# Altium schematic sheet FIT_HDMI_X31-7.SchDoc: FIT_PM12 board
size 420 x 297 mm; CheckedBy: G.Kasprowicz; Author: INR Moscow; CompanyName: WUT ISE; DrawnBy: M.Podgórski; Organization: WUT ISE; Address1: PW ISE; Address2: Nowowiejska 15/19 00-665 Warsaw; Address3: gkasprow@gmail.com; Revision: 2; SheetNumber: -; SheetTotal: -; ModifiedBy: -; CheckedDate: -; Title2: Title 2; DivGrp: WUT ISE; Designer: INR RAS; ModifiedDate: -; ProjectName: Sensor Box
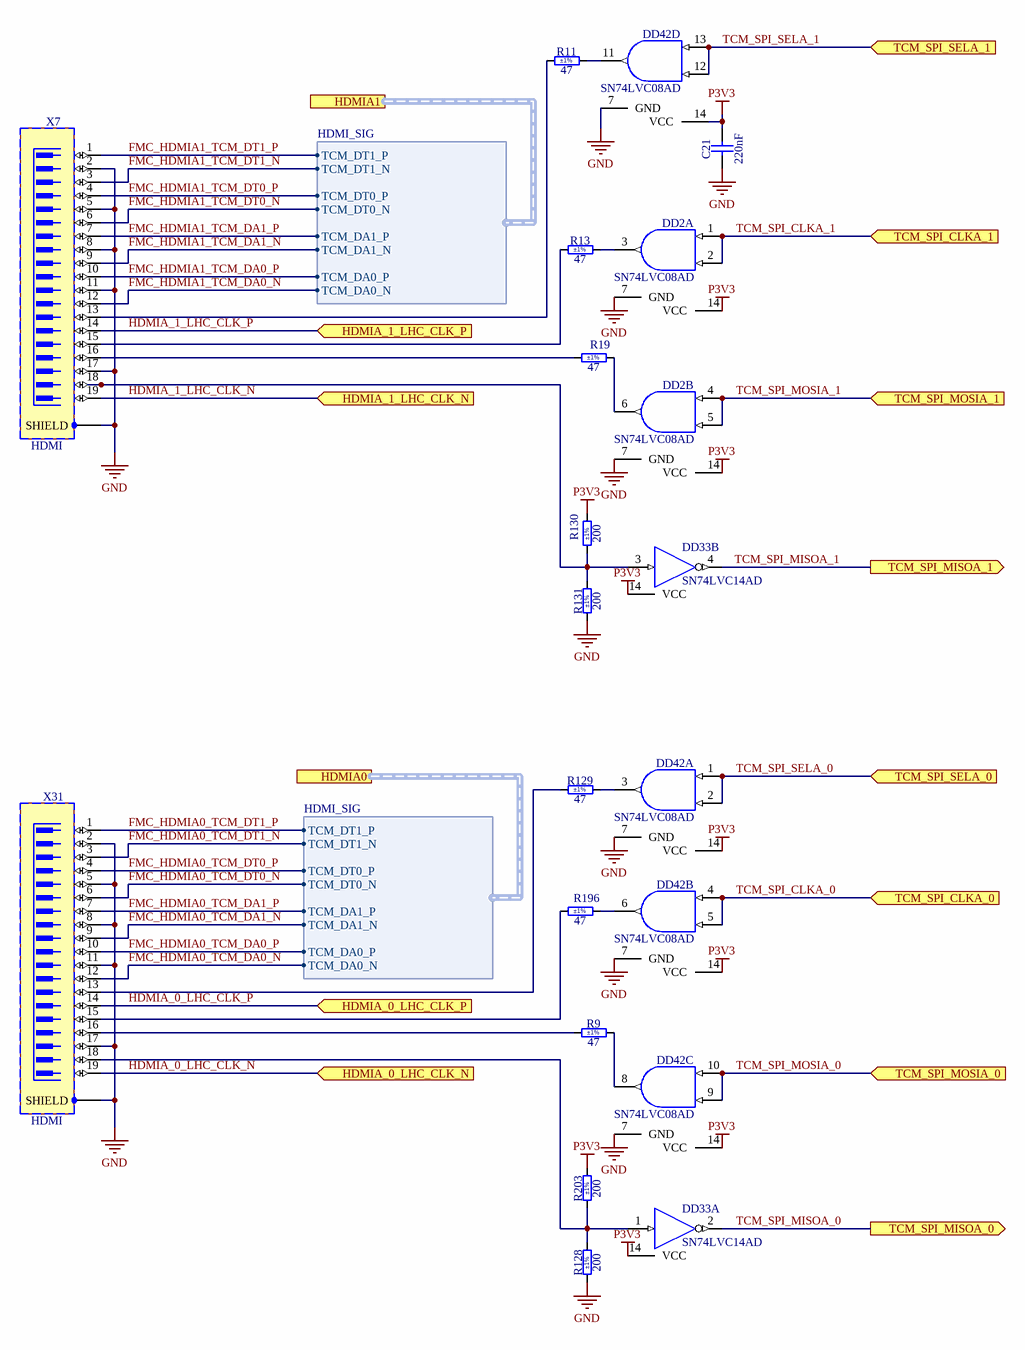
[diagram p0: FIT_HDMI_X31-7.SchDoc]

## Parts
C21  220nF  [CAPC2012X135N]
DD2  SN74LVC08AD  [SOIC127P600X175-14N]  (parts A,B of 4)
DD33  SN74LVC14AD  [SOIC127P600X175-14N]  (parts A,B of 6)
DD42  SN74LVC08AD  [SOIC127P600X175-14N]  (parts A,B,C,D of 4)
R9  47  Tolerance: ±1%  [RESC2012X60N]
R11  47  Tolerance: ±1%  [RESC2012X60N]
R13  47  Tolerance: ±1%  [RESC2012X60N]
R19  47  Tolerance: ±1%  [RESC2012X60N]
R128  200  Tolerance: ±1%  [RESC2012X60N]
R129  47  Tolerance: ±1%  [RESC2012X60N]
R130  200  Tolerance: ±1%  [RESC2012X60N]
R131  200  Tolerance: ±1%  [RESC2012X60N]
R196  47  Tolerance: ±1%  [RESC2012X60N]
R203  200  Tolerance: ±1%  [RESC2012X60N]
X7  HDMI  [TYCO_2007435-1]
X31  HDMI  [TYCO_2007435-1]

## Ports
HDMIA0 (harness HDMI_SIG), HDMIA1 (harness HDMI_SIG), HDMIA_0_LHC_CLK_N (in), HDMIA_0_LHC_CLK_P (in), HDMIA_1_LHC_CLK_N (in), HDMIA_1_LHC_CLK_P (in), TCM_SPI_CLKA_0 (in), TCM_SPI_CLKA_1 (in), TCM_SPI_MISOA_0 (out), TCM_SPI_MISOA_1 (out), TCM_SPI_MOSIA_0 (in), TCM_SPI_MOSIA_1 (in), TCM_SPI_SELA_0 (in), TCM_SPI_SELA_1 (in)

## Harnesses
HDMI_SIG: TCM_DT1_P, TCM_DT1_N, TCM_DT0_P, TCM_DT0_N, TCM_DA1_P, TCM_DA1_N, TCM_DA0_P, TCM_DA0_N

## Nets
GND: C21.1 DD2.7(GND) DD33.7(GND) DD42.7(GND) R128.1 R131.1 X7.2 X7.5 X7.8 X7.11 X7.17 X7.SHIELD X31.2 X31.5 X31.8 X31.11 X31.17 X31.SHIELD
P3V3: C21.2 DD2.14(VCC) DD33.14(VCC) DD42.14(VCC) R130.2 R203.2  [also labelled VCC]
FMC_HDMIA0_TCM_DA0_N: X31.12 ; port HDMIA0.TCM_DA0_N
FMC_HDMIA0_TCM_DA0_P: X31.10 ; port HDMIA0.TCM_DA0_P
FMC_HDMIA0_TCM_DA1_N: X31.9 ; port HDMIA0.TCM_DA1_N
FMC_HDMIA0_TCM_DA1_P: X31.7 ; port HDMIA0.TCM_DA1_P
FMC_HDMIA0_TCM_DT0_N: X31.6 ; port HDMIA0.TCM_DT0_N
FMC_HDMIA0_TCM_DT0_P: X31.4 ; port HDMIA0.TCM_DT0_P
FMC_HDMIA0_TCM_DT1_N: X31.3 ; port HDMIA0.TCM_DT1_N
FMC_HDMIA0_TCM_DT1_P: X31.1 ; port HDMIA0.TCM_DT1_P
FMC_HDMIA1_TCM_DA0_N: X7.12 ; port HDMIA1.TCM_DA0_N
FMC_HDMIA1_TCM_DA0_P: X7.10 ; port HDMIA1.TCM_DA0_P
FMC_HDMIA1_TCM_DA1_N: X7.9 ; port HDMIA1.TCM_DA1_N
FMC_HDMIA1_TCM_DA1_P: X7.7 ; port HDMIA1.TCM_DA1_P
FMC_HDMIA1_TCM_DT0_N: X7.6 ; port HDMIA1.TCM_DT0_N
FMC_HDMIA1_TCM_DT0_P: X7.4 ; port HDMIA1.TCM_DT0_P
FMC_HDMIA1_TCM_DT1_N: X7.3 ; port HDMIA1.TCM_DT1_N
FMC_HDMIA1_TCM_DT1_P: X7.1 ; port HDMIA1.TCM_DT1_P
HDMIA_0_LHC_CLK_N: X31.19 ; port HDMIA_0_LHC_CLK_N
HDMIA_0_LHC_CLK_P: X31.14 ; port HDMIA_0_LHC_CLK_P
HDMIA_1_LHC_CLK_N: X7.19 ; port HDMIA_1_LHC_CLK_N
HDMIA_1_LHC_CLK_P: X7.14 ; port HDMIA_1_LHC_CLK_P
TCM_SPI_CLKA_0: DD42.4(A) DD42.5(B) ; port TCM_SPI_CLKA_0
TCM_SPI_CLKA_1: DD2.1(A) DD2.2(B) ; port TCM_SPI_CLKA_1
TCM_SPI_MISOA_0: DD33.2(OUT) ; port TCM_SPI_MISOA_0
TCM_SPI_MISOA_1: DD33.4(OUT) ; port TCM_SPI_MISOA_1
TCM_SPI_MOSIA_0: DD42.9(B) DD42.10(A) ; port TCM_SPI_MOSIA_0
TCM_SPI_MOSIA_1: DD2.4(A) DD2.5(B) ; port TCM_SPI_MOSIA_1
TCM_SPI_SELA_0: DD42.1(A) DD42.2(B) ; port TCM_SPI_SELA_0
TCM_SPI_SELA_1: DD42.12(B) DD42.13(A) ; port TCM_SPI_SELA_1
NetDD2_3: DD2.3(Y) R13.2
NetDD2_6: DD2.6(Y) R19.2
NetDD33_1: DD33.1(IN) R128.2 R203.1 X31.18
NetDD33_3: DD33.3(IN) R130.1 R131.2 X7.18
NetDD42_3: DD42.3(Y) R129.2
NetDD42_6: DD42.6(Y) R196.2
NetDD42_8: DD42.8(Y) R9.2
NetDD42_11: DD42.11(Y) R11.2
NetR9_1: R9.1 X31.16
NetR11_1: R11.1 X7.13
NetR13_1: R13.1 X7.15
NetR19_1: R19.1 X7.16
NetR129_1: R129.1 X31.13
NetR196_1: R196.1 X31.15

## Notes on the sheet
- Project/Equipment
- Document
- Designer
- Drawn by
- Check.by
- Copyright WUT ISE 2024.
  This documentation describes Open Hardware and is licensed under the CERN OHL v.2. You may redistribute and modify this documentation under the terms of the CERN OHL v.2. (http://ohwr.org/CERNOHL). This documentation is distributed WITHOUT ANY EXPRESS OR IMPLIED WARRANTY, INCLUDING OF MERCHANTABILITY, SATISFACTORY QUALITY AND FITNESS FOR A PARTICULAR PURPOSE. Please see the CERN OHL v.2 for applicable conditions.
- Contact
- File
- Last Mod.
- Print Date
- Sheet
- Size
- A3
- of
- Rev

## Library data of the parts
C21 = CC0805_220NF_50V_10%_X7R: Non-polarised capacitor; Part Description: SMD Multilayer Chip Ceramic Capacitor; Manufacturer: GENERIC; Manufacturer1 Part Number: GRM21BR71H224KA01L; Voltage: 50V; TC: X7R; Tolerance: ±10%; Part Number: CC0805_220NF_50V_10%_X7R; Component Kind: Standard; Component Type: Standard; Pin Count: 2; Value: 220nF; Status: Preferred; Manufacturer Part Number: CC0805_220NF_50V_10%_X7R; Case: 0805; Mounted: Yes; Socket: No; SMD: Yes; Sense: No; Manufacturer1 Example: MURATA; Manufacturer1 ComponentHeight: 1.35mm; HelpURL: \\cern.ch\dfs\Applications\Altium\Datasheets\CC0805_X7R_MURATA.pdf; Author: CERN DEM JLC; CreateDate: 03.12.2007; LatestRevisionDate: 03.12.2007
DD2 DD42 = SN74LVC08AD: Quad 2-Input AND Gate; Part Description: Quadruple 2-Input Positive-AND Gate; Manufacturer: TEXAS INSTRUMENTS; PressFit: No; Bonding: No; Part Number: SN74LVC08AD; Component Kind: Standard; Component Type: Standard; Device: SN74LVC08AD; PackageDescription: SOIC 14, Pitch 1.27mm - Body 4x8.75mm, IPC Medium Density; Manufacturer Part Number: SN74LVC08AD; Pin Count: 14; Case: SOIC14; Mounted: Yes; Socket: No; SMD: Yes; Sense: No; ComponentHeight: 1.75mm; Author: CERN DEM JLC; HelpURL: \\cern.ch\dfs\Applications\Altium\Datasheets\SN74LVC08AD.pdf; CreateDate: 21.03.2012; LatestRevisionDate: 21.03.2012
DD33 = SN74LVC14AD: Hex Schmitt-Trigger Inverter; Manufacturer: TEXAS INSTRUMENTS; PressFit: No; Bonding: No; Part Number: SN74LVC14AD; Component Kind: Standard; Component Type: Standard; Device: SN74LVC14AD; PackageDescription: SOIC 14, Pitch 1.27mm - Body 4x8.75mm, IPC Medium Density; Part Description: Hex Schmitt-Trigger Inverter; Manufacturer Part Number: SN74LVC14AD; Pin Count: 14; Case: SOIC14; Mounted: Yes; Socket: No; SMD: Yes; Sense: No; ComponentHeight: 1.75mm; Author: CERN DEM JMW; HelpURL: \\cern.ch\dfs\Applications\Altium\Datasheets\SN74LVC14AD.pdf; CreateDate: 29.09.2008; LatestRevisionDate: 29.09.2008
R9 R11 R13 R19 R129 R196 = R0805_47R_1%_0.125W_100PPM: Resistor - 1%; Part Description: General Purpose Thick Film Chip Resistor; Manufacturer: GENERIC; Manufacturer1 Part Number: NRC10F47R0TRF; Power: 0.125W; TC: ±100ppm/°C; PressFit: No; Part Number: R0805_47R_1%_0.125W_100PPM; Component Kind: Standard; Component Type: Standard; Pin Count: 2; Value: 47; Status: Preferred; Manufacturer Part Number: R0805_47R_1%_0.125W_100PPM; Case: 0805; Mounted: Yes; Sense: No; Socket: No; SMD: Yes; Manufacturer1 Example: NIC COMPONENT; Manufacturer1 ComponentHeight: 0.6mm; HelpURL: \\cern.ch\dfs\Applications\Altium\Datasheets\R0805_NIC_NRC.pdf; Author: CERN DEM JLC; CreateDate: 03.12.2007; LatestRevisionDate: 13.03.2008
R128 R130 R131 R203 = R0805_200R_1%_0.125W_100PPM: Resistor - 1%; Part Description: General Purpose Thick Film Chip Resistor; Manufacturer: GENERIC; Manufacturer1 Part Number: NRC10F2000TRF; Power: 0.125W; TC: ±100ppm/°C; PressFit: No; Part Number: R0805_200R_1%_0.125W_100PPM; Component Kind: Standard; Component Type: Standard; Pin Count: 2; Value: 200; Status: Preferred; Manufacturer Part Number: R0805_200R_1%_0.125W_100PPM; Case: 0805; Mounted: Yes; Sense: No; Socket: No; SMD: Yes; Manufacturer1 Example: NIC COMPONENT; Manufacturer1 ComponentHeight: 0.6mm; HelpURL: \\cern.ch\dfs\Applications\Altium\Datasheets\R0805_NIC_NRC.pdf; Author: CERN DEM JLC; CreateDate: 03.12.2007; LatestRevisionDate: 13.03.2008
X7 X31 = TYCO_2007435-1: Connector HDMI 19 Male + 1 Shield; Part Description: 0.578mm Pitch, Through-Hole Right Angle 19 Contacts Flag-HDMI Type-A Receptacle Thru Hole Mounting Pads; Manufacturer: TYCO ELECTRONICS; PressFit: No; Part Number: TYCO_2007435-1; Component Kind: Standard; Component Type: Standard; Pin Count: 23; Family: HDMI; Mounted: Yes; Socket: No; SMD: No; Sense: No; Status: None; Manufacturer Part Number: 2007435-1; ComponentHeight: 16.4mm; HelpURL: \\cern.ch\dfs\Applications\Altium\Datasheets\TYCO_2007435-1.pdf; Author: CERN DEM MR; CreateDate: 05.07.2016; LatestRevisionDate: 05.07.2016